# Altium project WS2812_MATRIX.PrjPcb
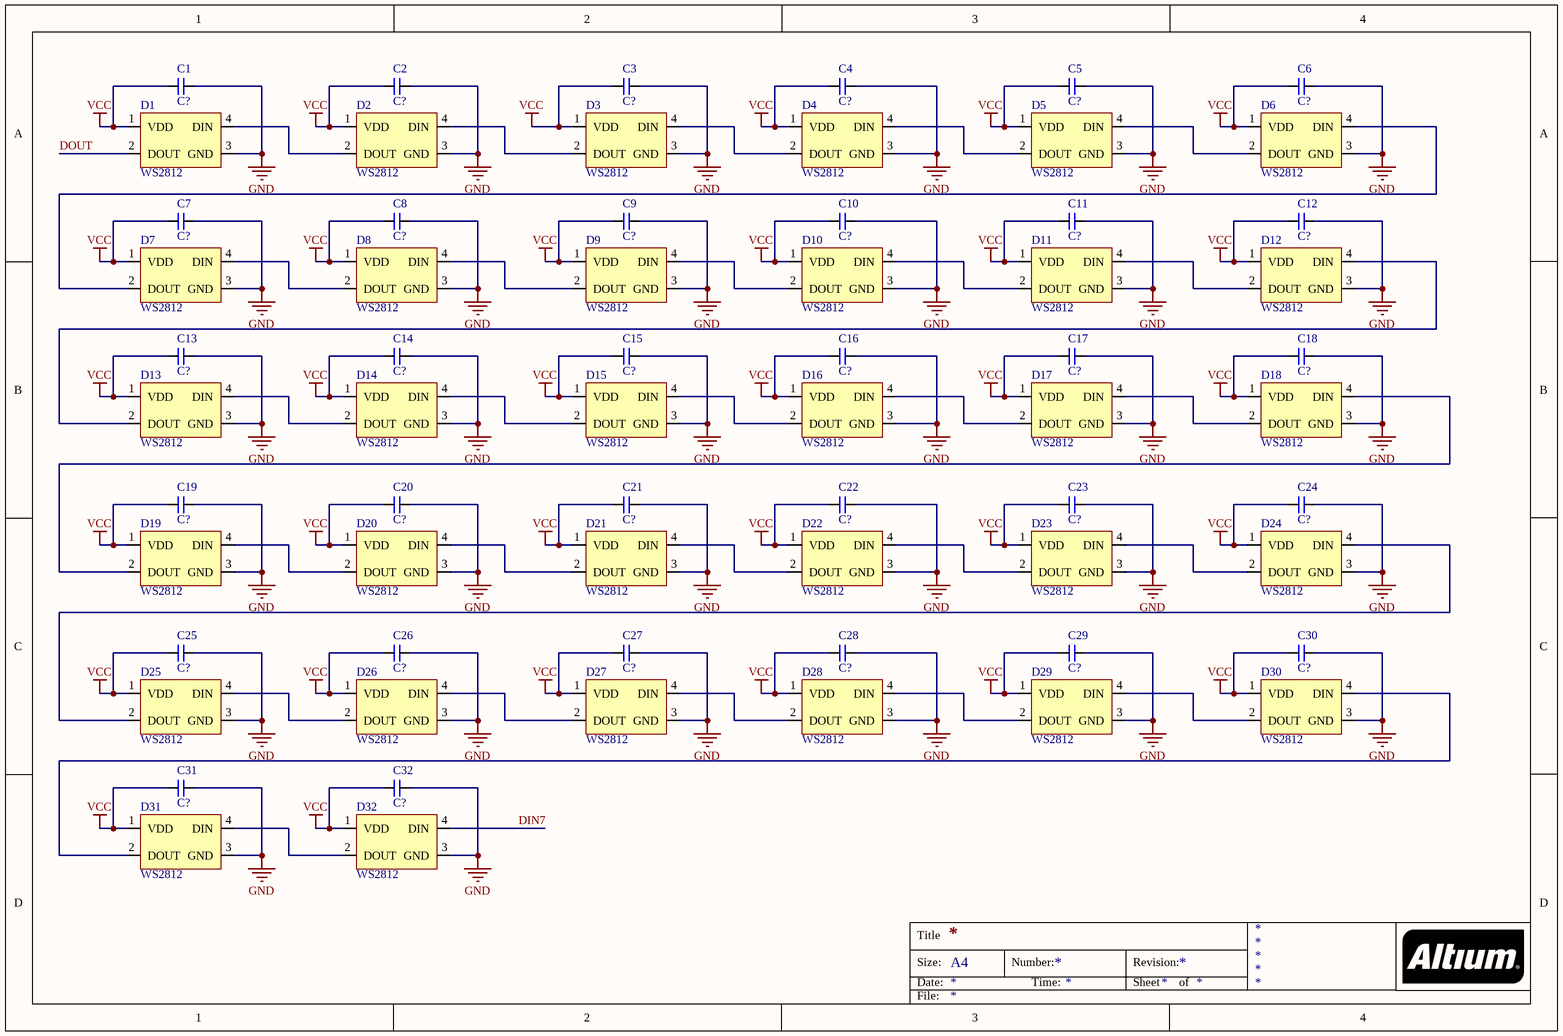
[diagram p0: WS2812_MATRIX_1.SchDoc]
8 sheets, 516 parts. Net scope: global (net labels, ports and power ports of the same name join across sheets).
Board file: WS2812_MATRIX.PcbDoc
Sheets:
  WS2812_MATRIX_1.SchDoc
  WS2812_MATRIX_2.SchDoc
  WS2812_MATRIX_3.SchDoc
  WS2812_MATRIX_4.SchDoc
  WS2812_MATRIX_5.SchDoc
  WS2812_MATRIX_6.SchDoc
  WS2812_MATRIX_7.SchDoc
  WS2812_MATRIX_8.SchDoc

## Sheet WS2812_MATRIX_1.SchDoc
size A4

### Parts
C1  C?  [C0603]
C2  C?  [C0603]
C3  C?  [C0603]
C4  C?  [C0603]
C5  C?  [C0603]
C6  C?  [C0603]
C7  C?  [C0603]
C8  C?  [C0603]
C9  C?  [C0603]
C10  C?  [C0603]
C11  C?  [C0603]
C12  C?  [C0603]
C13  C?  [C0603]
C14  C?  [C0603]
C15  C?  [C0603]
C16  C?  [C0603]
C17  C?  [C0603]
C18  C?  [C0603]
C19  C?  [C0603]
C20  C?  [C0603]
C21  C?  [C0603]
C22  C?  [C0603]
C23  C?  [C0603]
C24  C?  [C0603]
C25  C?  [C0603]
C26  C?  [C0603]
C27  C?  [C0603]
C28  C?  [C0603]
C29  C?  [C0603]
C30  C?  [C0603]
C31  C?  [C0603]
C32  C?  [C0603]
D1  WS2812  [WS2812_3528]
D2  WS2812  [WS2812_3528]
D3  WS2812  [WS2812_3528]
D4  WS2812  [WS2812_3528]
D5  WS2812  [WS2812_3528]
D6  WS2812  [WS2812_3528]
D7  WS2812  [WS2812_3528]
D8  WS2812  [WS2812_3528]
D9  WS2812  [WS2812_3528]
D10  WS2812  [WS2812_3528]
D11  WS2812  [WS2812_3528]
D12  WS2812  [WS2812_3528]
D13  WS2812  [WS2812_3528]
D14  WS2812  [WS2812_3528]
D15  WS2812  [WS2812_3528]
D16  WS2812  [WS2812_3528]
D17  WS2812  [WS2812_3528]
D18  WS2812  [WS2812_3528]
D19  WS2812  [WS2812_3528]
D20  WS2812  [WS2812_3528]
D21  WS2812  [WS2812_3528]
D22  WS2812  [WS2812_3528]
D23  WS2812  [WS2812_3528]
D24  WS2812  [WS2812_3528]
D25  WS2812  [WS2812_3528]
D26  WS2812  [WS2812_3528]
D27  WS2812  [WS2812_3528]
D28  WS2812  [WS2812_3528]
D29  WS2812  [WS2812_3528]
D30  WS2812  [WS2812_3528]
D31  WS2812  [WS2812_3528]
D32  WS2812  [WS2812_3528]

### Nets
GND: C1.2 C2.2 C3.2 C4.2 C5.2 C6.2 C7.2 C8.2 C9.2 C10.2 C11.2 C12.2 C13.2 C14.2 C15.2 C16.2 C17.2 C18.2 C19.2 C20.2 C21.2 C22.2 C23.2 C24.2 C25.2 C26.2 C27.2 C28.2 C29.2 C30.2 C31.2 C32.2 D1.3(GND) D2.3(GND) D3.3(GND) D4.3(GND) D5.3(GND) D6.3(GND) D7.3(GND) D8.3(GND) D9.3(GND) D10.3(GND) D11.3(GND) D12.3(GND) D13.3(GND) D14.3(GND) D15.3(GND) D16.3(GND) D17.3(GND) D18.3(GND) D19.3(GND) D20.3(GND) D21.3(GND) D22.3(GND) D23.3(GND) D24.3(GND) D25.3(GND) D26.3(GND) D27.3(GND) D28.3(GND) D29.3(GND) D30.3(GND) D31.3(GND) D32.3(GND)
VCC: C1.1 C2.1 C3.1 C4.1 C5.1 C6.1 C7.1 C8.1 C9.1 C10.1 C11.1 C12.1 C13.1 C14.1 C15.1 C16.1 C17.1 C18.1 C19.1 C20.1 C21.1 C22.1 C23.1 C24.1 C25.1 C26.1 C27.1 C28.1 C29.1 C30.1 C31.1 C32.1 D1.1(VDD) D2.1(VDD) D3.1(VDD) D4.1(VDD) D5.1(VDD) D6.1(VDD) D7.1(VDD) D8.1(VDD) D9.1(VDD) D10.1(VDD) D11.1(VDD) D12.1(VDD) D13.1(VDD) D14.1(VDD) D15.1(VDD) D16.1(VDD) D17.1(VDD) D18.1(VDD) D19.1(VDD) D20.1(VDD) D21.1(VDD) D22.1(VDD) D23.1(VDD) D24.1(VDD) D25.1(VDD) D26.1(VDD) D27.1(VDD) D28.1(VDD) D29.1(VDD) D30.1(VDD) D31.1(VDD) D32.1(VDD)
DIN7: D32.4(DIN)
DOUT: D1.2(DOUT)
NetD1_4: D1.4(DIN) D2.2(DOUT)
NetD2_4: D2.4(DIN) D3.2(DOUT)
NetD3_4: D3.4(DIN) D4.2(DOUT)
NetD4_4: D4.4(DIN) D5.2(DOUT)
NetD5_4: D5.4(DIN) D6.2(DOUT)
NetD6_4: D6.4(DIN) D7.2(DOUT)
NetD7_4: D7.4(DIN) D8.2(DOUT)
NetD8_4: D8.4(DIN) D9.2(DOUT)
NetD9_4: D9.4(DIN) D10.2(DOUT)
NetD10_4: D10.4(DIN) D11.2(DOUT)
NetD11_4: D11.4(DIN) D12.2(DOUT)
NetD12_4: D12.4(DIN) D13.2(DOUT)
NetD13_4: D13.4(DIN) D14.2(DOUT)
NetD14_4: D14.4(DIN) D15.2(DOUT)
NetD15_4: D15.4(DIN) D16.2(DOUT)
NetD16_4: D16.4(DIN) D17.2(DOUT)
NetD17_4: D17.4(DIN) D18.2(DOUT)
NetD18_4: D18.4(DIN) D19.2(DOUT)
NetD19_4: D19.4(DIN) D20.2(DOUT)
NetD20_4: D20.4(DIN) D21.2(DOUT)
NetD21_4: D21.4(DIN) D22.2(DOUT)
NetD22_4: D22.4(DIN) D23.2(DOUT)
NetD23_4: D23.4(DIN) D24.2(DOUT)
NetD24_4: D24.4(DIN) D25.2(DOUT)
NetD25_4: D25.4(DIN) D26.2(DOUT)
NetD26_4: D26.4(DIN) D27.2(DOUT)
NetD27_4: D27.4(DIN) D28.2(DOUT)
NetD28_4: D28.4(DIN) D29.2(DOUT)
NetD29_4: D29.4(DIN) D30.2(DOUT)
NetD30_4: D30.4(DIN) D31.2(DOUT)
NetD31_4: D31.4(DIN) D32.2(DOUT)

### Notes on the sheet
- Title
- Size:
- Date:
- A4
- Number:
- Time:
- Revision:
- Sheet
- of
- File:

### Library data of the parts
C1-C32 = CAP

## Sheet WS2812_MATRIX_2.SchDoc
size A4
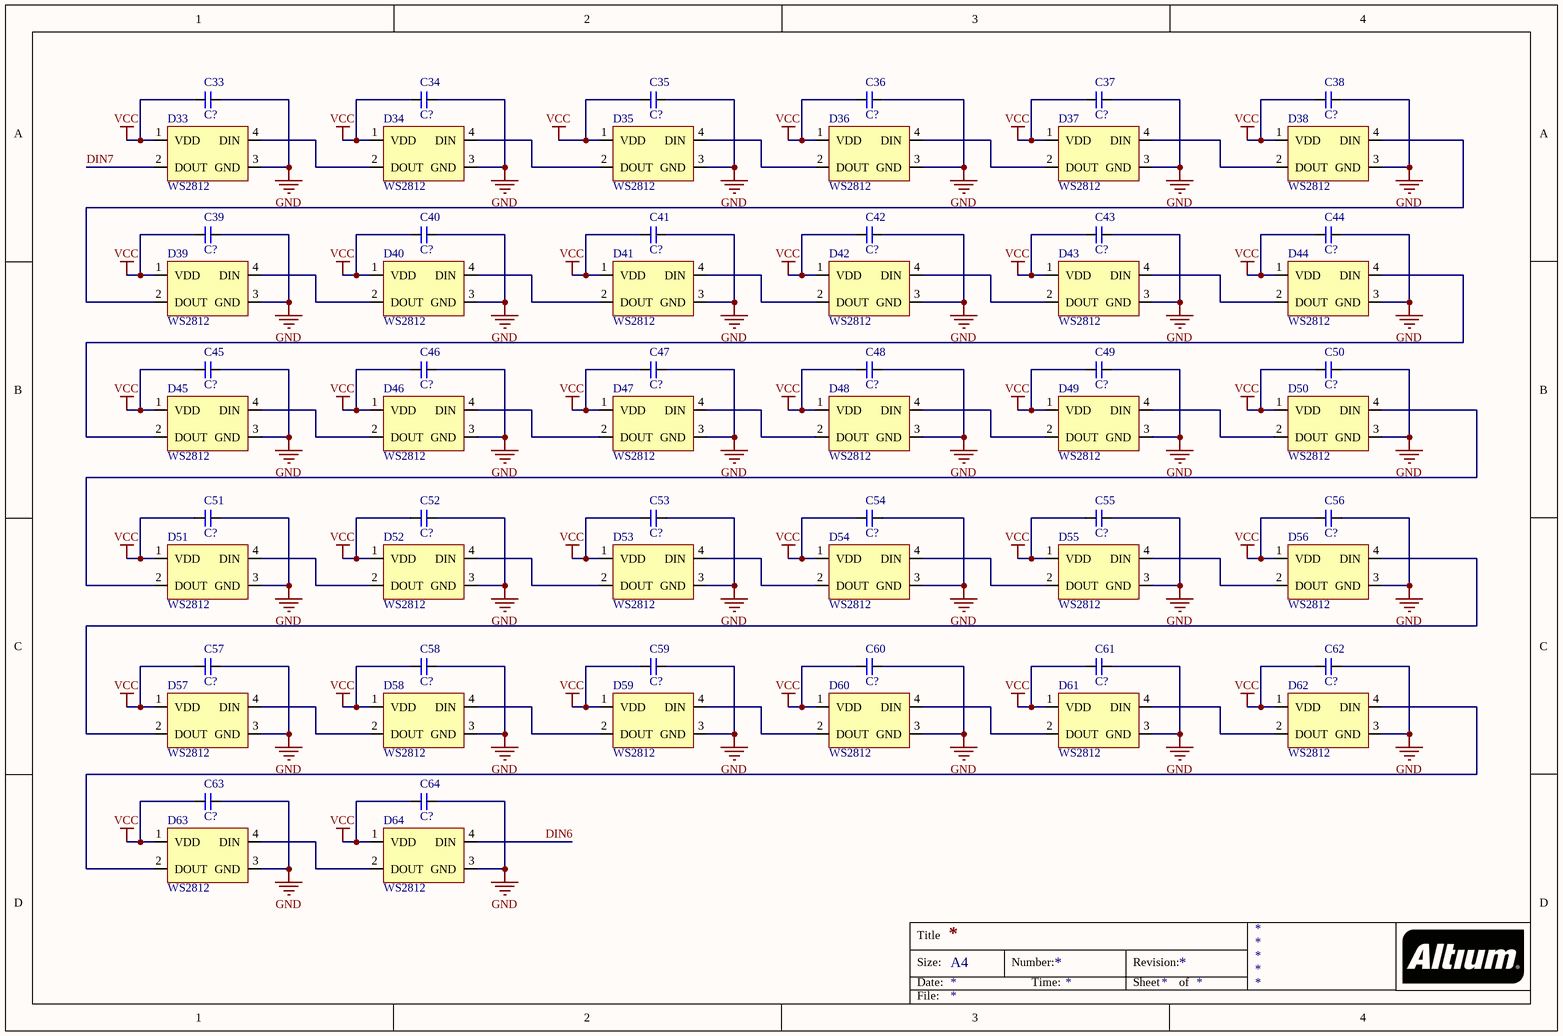
[diagram p1: WS2812_MATRIX_2.SchDoc]

### Parts
C33  C?  [C0603]
C34  C?  [C0603]
C35  C?  [C0603]
C36  C?  [C0603]
C37  C?  [C0603]
C38  C?  [C0603]
C39  C?  [C0603]
C40  C?  [C0603]
C41  C?  [C0603]
C42  C?  [C0603]
C43  C?  [C0603]
C44  C?  [C0603]
C45  C?  [C0603]
C46  C?  [C0603]
C47  C?  [C0603]
C48  C?  [C0603]
C49  C?  [C0603]
C50  C?  [C0603]
C51  C?  [C0603]
C52  C?  [C0603]
C53  C?  [C0603]
C54  C?  [C0603]
C55  C?  [C0603]
C56  C?  [C0603]
C57  C?  [C0603]
C58  C?  [C0603]
C59  C?  [C0603]
C60  C?  [C0603]
C61  C?  [C0603]
C62  C?  [C0603]
C63  C?  [C0603]
C64  C?  [C0603]
D33  WS2812  [WS2812_3528]
D34  WS2812  [WS2812_3528]
D35  WS2812  [WS2812_3528]
D36  WS2812  [WS2812_3528]
D37  WS2812  [WS2812_3528]
D38  WS2812  [WS2812_3528]
D39  WS2812  [WS2812_3528]
D40  WS2812  [WS2812_3528]
D41  WS2812  [WS2812_3528]
D42  WS2812  [WS2812_3528]
D43  WS2812  [WS2812_3528]
D44  WS2812  [WS2812_3528]
D45  WS2812  [WS2812_3528]
D46  WS2812  [WS2812_3528]
D47  WS2812  [WS2812_3528]
D48  WS2812  [WS2812_3528]
D49  WS2812  [WS2812_3528]
D50  WS2812  [WS2812_3528]
D51  WS2812  [WS2812_3528]
D52  WS2812  [WS2812_3528]
D53  WS2812  [WS2812_3528]
D54  WS2812  [WS2812_3528]
D55  WS2812  [WS2812_3528]
D56  WS2812  [WS2812_3528]
D57  WS2812  [WS2812_3528]
D58  WS2812  [WS2812_3528]
D59  WS2812  [WS2812_3528]
D60  WS2812  [WS2812_3528]
D61  WS2812  [WS2812_3528]
D62  WS2812  [WS2812_3528]
D63  WS2812  [WS2812_3528]
D64  WS2812  [WS2812_3528]

### Nets
GND: C33.2 C34.2 C35.2 C36.2 C37.2 C38.2 C39.2 C40.2 C41.2 C42.2 C43.2 C44.2 C45.2 C46.2 C47.2 C48.2 C49.2 C50.2 C51.2 C52.2 C53.2 C54.2 C55.2 C56.2 C57.2 C58.2 C59.2 C60.2 C61.2 C62.2 C63.2 C64.2 D33.3(GND) D34.3(GND) D35.3(GND) D36.3(GND) D37.3(GND) D38.3(GND) D39.3(GND) D40.3(GND) D41.3(GND) D42.3(GND) D43.3(GND) D44.3(GND) D45.3(GND) D46.3(GND) D47.3(GND) D48.3(GND) D49.3(GND) D50.3(GND) D51.3(GND) D52.3(GND) D53.3(GND) D54.3(GND) D55.3(GND) D56.3(GND) D57.3(GND) D58.3(GND) D59.3(GND) D60.3(GND) D61.3(GND) D62.3(GND) D63.3(GND) D64.3(GND)
VCC: C33.1 C34.1 C35.1 C36.1 C37.1 C38.1 C39.1 C40.1 C41.1 C42.1 C43.1 C44.1 C45.1 C46.1 C47.1 C48.1 C49.1 C50.1 C51.1 C52.1 C53.1 C54.1 C55.1 C56.1 C57.1 C58.1 C59.1 C60.1 C61.1 C62.1 C63.1 C64.1 D33.1(VDD) D34.1(VDD) D35.1(VDD) D36.1(VDD) D37.1(VDD) D38.1(VDD) D39.1(VDD) D40.1(VDD) D41.1(VDD) D42.1(VDD) D43.1(VDD) D44.1(VDD) D45.1(VDD) D46.1(VDD) D47.1(VDD) D48.1(VDD) D49.1(VDD) D50.1(VDD) D51.1(VDD) D52.1(VDD) D53.1(VDD) D54.1(VDD) D55.1(VDD) D56.1(VDD) D57.1(VDD) D58.1(VDD) D59.1(VDD) D60.1(VDD) D61.1(VDD) D62.1(VDD) D63.1(VDD) D64.1(VDD)
DIN6: D64.4(DIN)
DIN7: D33.2(DOUT)
NetD33_4: D33.4(DIN) D34.2(DOUT)
NetD34_4: D34.4(DIN) D35.2(DOUT)
NetD35_4: D35.4(DIN) D36.2(DOUT)
NetD36_4: D36.4(DIN) D37.2(DOUT)
NetD37_4: D37.4(DIN) D38.2(DOUT)
NetD38_4: D38.4(DIN) D39.2(DOUT)
NetD39_4: D39.4(DIN) D40.2(DOUT)
NetD40_4: D40.4(DIN) D41.2(DOUT)
NetD41_4: D41.4(DIN) D42.2(DOUT)
NetD42_4: D42.4(DIN) D43.2(DOUT)
NetD43_4: D43.4(DIN) D44.2(DOUT)
NetD44_4: D44.4(DIN) D45.2(DOUT)
NetD45_4: D45.4(DIN) D46.2(DOUT)
NetD46_4: D46.4(DIN) D47.2(DOUT)
NetD47_4: D47.4(DIN) D48.2(DOUT)
NetD48_4: D48.4(DIN) D49.2(DOUT)
NetD49_4: D49.4(DIN) D50.2(DOUT)
NetD50_4: D50.4(DIN) D51.2(DOUT)
NetD51_4: D51.4(DIN) D52.2(DOUT)
NetD52_4: D52.4(DIN) D53.2(DOUT)
NetD53_4: D53.4(DIN) D54.2(DOUT)
NetD54_4: D54.4(DIN) D55.2(DOUT)
NetD55_4: D55.4(DIN) D56.2(DOUT)
NetD56_4: D56.4(DIN) D57.2(DOUT)
NetD57_4: D57.4(DIN) D58.2(DOUT)
NetD58_4: D58.4(DIN) D59.2(DOUT)
NetD59_4: D59.4(DIN) D60.2(DOUT)
NetD60_4: D60.4(DIN) D61.2(DOUT)
NetD61_4: D61.4(DIN) D62.2(DOUT)
NetD62_4: D62.4(DIN) D63.2(DOUT)
NetD63_4: D63.4(DIN) D64.2(DOUT)

### Notes on the sheet
- Title
- Size:
- Date:
- A4
- Number:
- Time:
- Revision:
- Sheet
- of
- File:

### Library data of the parts
C33-C64 = CAP

## Sheet WS2812_MATRIX_3.SchDoc
size A4
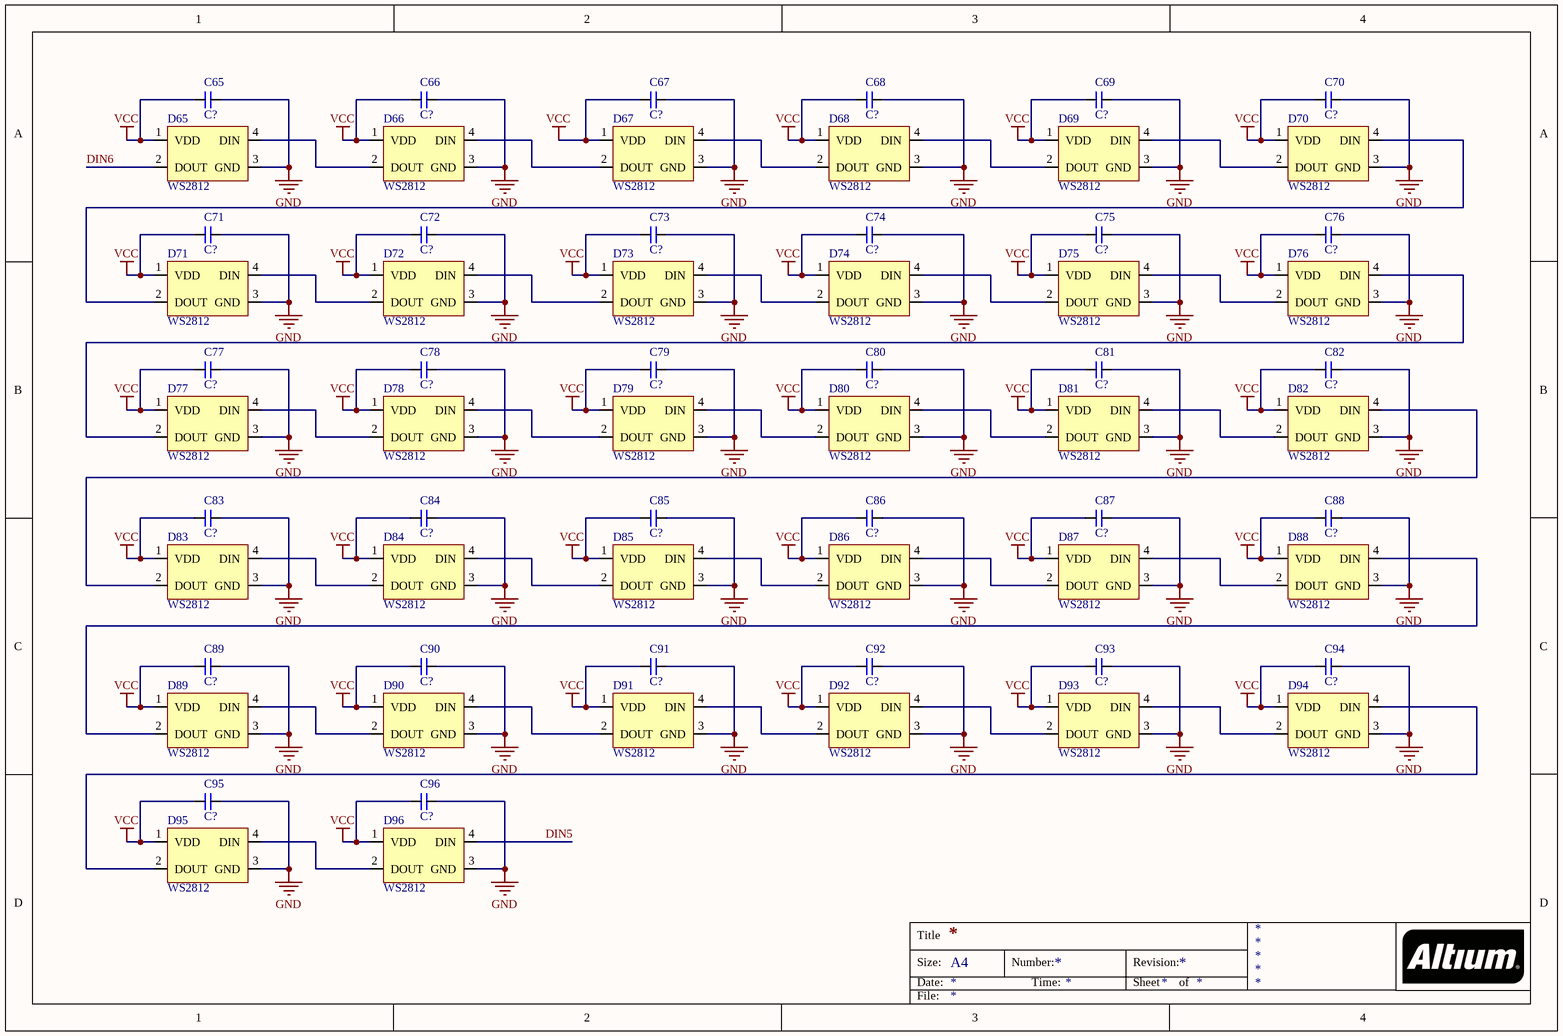
[diagram p2: WS2812_MATRIX_3.SchDoc]

### Parts
C65  C?  [C0603]
C66  C?  [C0603]
C67  C?  [C0603]
C68  C?  [C0603]
C69  C?  [C0603]
C70  C?  [C0603]
C71  C?  [C0603]
C72  C?  [C0603]
C73  C?  [C0603]
C74  C?  [C0603]
C75  C?  [C0603]
C76  C?  [C0603]
C77  C?  [C0603]
C78  C?  [C0603]
C79  C?  [C0603]
C80  C?  [C0603]
C81  C?  [C0603]
C82  C?  [C0603]
C83  C?  [C0603]
C84  C?  [C0603]
C85  C?  [C0603]
C86  C?  [C0603]
C87  C?  [C0603]
C88  C?  [C0603]
C89  C?  [C0603]
C90  C?  [C0603]
C91  C?  [C0603]
C92  C?  [C0603]
C93  C?  [C0603]
C94  C?  [C0603]
C95  C?  [C0603]
C96  C?  [C0603]
D65  WS2812  [WS2812_3528]
D66  WS2812  [WS2812_3528]
D67  WS2812  [WS2812_3528]
D68  WS2812  [WS2812_3528]
D69  WS2812  [WS2812_3528]
D70  WS2812  [WS2812_3528]
D71  WS2812  [WS2812_3528]
D72  WS2812  [WS2812_3528]
D73  WS2812  [WS2812_3528]
D74  WS2812  [WS2812_3528]
D75  WS2812  [WS2812_3528]
D76  WS2812  [WS2812_3528]
D77  WS2812  [WS2812_3528]
D78  WS2812  [WS2812_3528]
D79  WS2812  [WS2812_3528]
D80  WS2812  [WS2812_3528]
D81  WS2812  [WS2812_3528]
D82  WS2812  [WS2812_3528]
D83  WS2812  [WS2812_3528]
D84  WS2812  [WS2812_3528]
D85  WS2812  [WS2812_3528]
D86  WS2812  [WS2812_3528]
D87  WS2812  [WS2812_3528]
D88  WS2812  [WS2812_3528]
D89  WS2812  [WS2812_3528]
D90  WS2812  [WS2812_3528]
D91  WS2812  [WS2812_3528]
D92  WS2812  [WS2812_3528]
D93  WS2812  [WS2812_3528]
D94  WS2812  [WS2812_3528]
D95  WS2812  [WS2812_3528]
D96  WS2812  [WS2812_3528]

### Nets
GND: C65.2 C66.2 C67.2 C68.2 C69.2 C70.2 C71.2 C72.2 C73.2 C74.2 C75.2 C76.2 C77.2 C78.2 C79.2 C80.2 C81.2 C82.2 C83.2 C84.2 C85.2 C86.2 C87.2 C88.2 C89.2 C90.2 C91.2 C92.2 C93.2 C94.2 C95.2 C96.2 D65.3(GND) D66.3(GND) D67.3(GND) D68.3(GND) D69.3(GND) D70.3(GND) D71.3(GND) D72.3(GND) D73.3(GND) D74.3(GND) D75.3(GND) D76.3(GND) D77.3(GND) D78.3(GND) D79.3(GND) D80.3(GND) D81.3(GND) D82.3(GND) D83.3(GND) D84.3(GND) D85.3(GND) D86.3(GND) D87.3(GND) D88.3(GND) D89.3(GND) D90.3(GND) D91.3(GND) D92.3(GND) D93.3(GND) D94.3(GND) D95.3(GND) D96.3(GND)
VCC: C65.1 C66.1 C67.1 C68.1 C69.1 C70.1 C71.1 C72.1 C73.1 C74.1 C75.1 C76.1 C77.1 C78.1 C79.1 C80.1 C81.1 C82.1 C83.1 C84.1 C85.1 C86.1 C87.1 C88.1 C89.1 C90.1 C91.1 C92.1 C93.1 C94.1 C95.1 C96.1 D65.1(VDD) D66.1(VDD) D67.1(VDD) D68.1(VDD) D69.1(VDD) D70.1(VDD) D71.1(VDD) D72.1(VDD) D73.1(VDD) D74.1(VDD) D75.1(VDD) D76.1(VDD) D77.1(VDD) D78.1(VDD) D79.1(VDD) D80.1(VDD) D81.1(VDD) D82.1(VDD) D83.1(VDD) D84.1(VDD) D85.1(VDD) D86.1(VDD) D87.1(VDD) D88.1(VDD) D89.1(VDD) D90.1(VDD) D91.1(VDD) D92.1(VDD) D93.1(VDD) D94.1(VDD) D95.1(VDD) D96.1(VDD)
DIN5: D96.4(DIN)
DIN6: D65.2(DOUT)
NetD65_4: D65.4(DIN) D66.2(DOUT)
NetD66_4: D66.4(DIN) D67.2(DOUT)
NetD67_4: D67.4(DIN) D68.2(DOUT)
NetD68_4: D68.4(DIN) D69.2(DOUT)
NetD69_4: D69.4(DIN) D70.2(DOUT)
NetD70_4: D70.4(DIN) D71.2(DOUT)
NetD71_4: D71.4(DIN) D72.2(DOUT)
NetD72_4: D72.4(DIN) D73.2(DOUT)
NetD73_4: D73.4(DIN) D74.2(DOUT)
NetD74_4: D74.4(DIN) D75.2(DOUT)
NetD75_4: D75.4(DIN) D76.2(DOUT)
NetD76_4: D76.4(DIN) D77.2(DOUT)
NetD77_4: D77.4(DIN) D78.2(DOUT)
NetD78_4: D78.4(DIN) D79.2(DOUT)
NetD79_4: D79.4(DIN) D80.2(DOUT)
NetD80_4: D80.4(DIN) D81.2(DOUT)
NetD81_4: D81.4(DIN) D82.2(DOUT)
NetD82_4: D82.4(DIN) D83.2(DOUT)
NetD83_4: D83.4(DIN) D84.2(DOUT)
NetD84_4: D84.4(DIN) D85.2(DOUT)
NetD85_4: D85.4(DIN) D86.2(DOUT)
NetD86_4: D86.4(DIN) D87.2(DOUT)
NetD87_4: D87.4(DIN) D88.2(DOUT)
NetD88_4: D88.4(DIN) D89.2(DOUT)
NetD89_4: D89.4(DIN) D90.2(DOUT)
NetD90_4: D90.4(DIN) D91.2(DOUT)
NetD91_4: D91.4(DIN) D92.2(DOUT)
NetD92_4: D92.4(DIN) D93.2(DOUT)
NetD93_4: D93.4(DIN) D94.2(DOUT)
NetD94_4: D94.4(DIN) D95.2(DOUT)
NetD95_4: D95.4(DIN) D96.2(DOUT)

### Notes on the sheet
- Title
- Size:
- Date:
- A4
- Number:
- Time:
- Revision:
- Sheet
- of
- File:

### Library data of the parts
C65-C96 = CAP

## Sheet WS2812_MATRIX_4.SchDoc
size A4
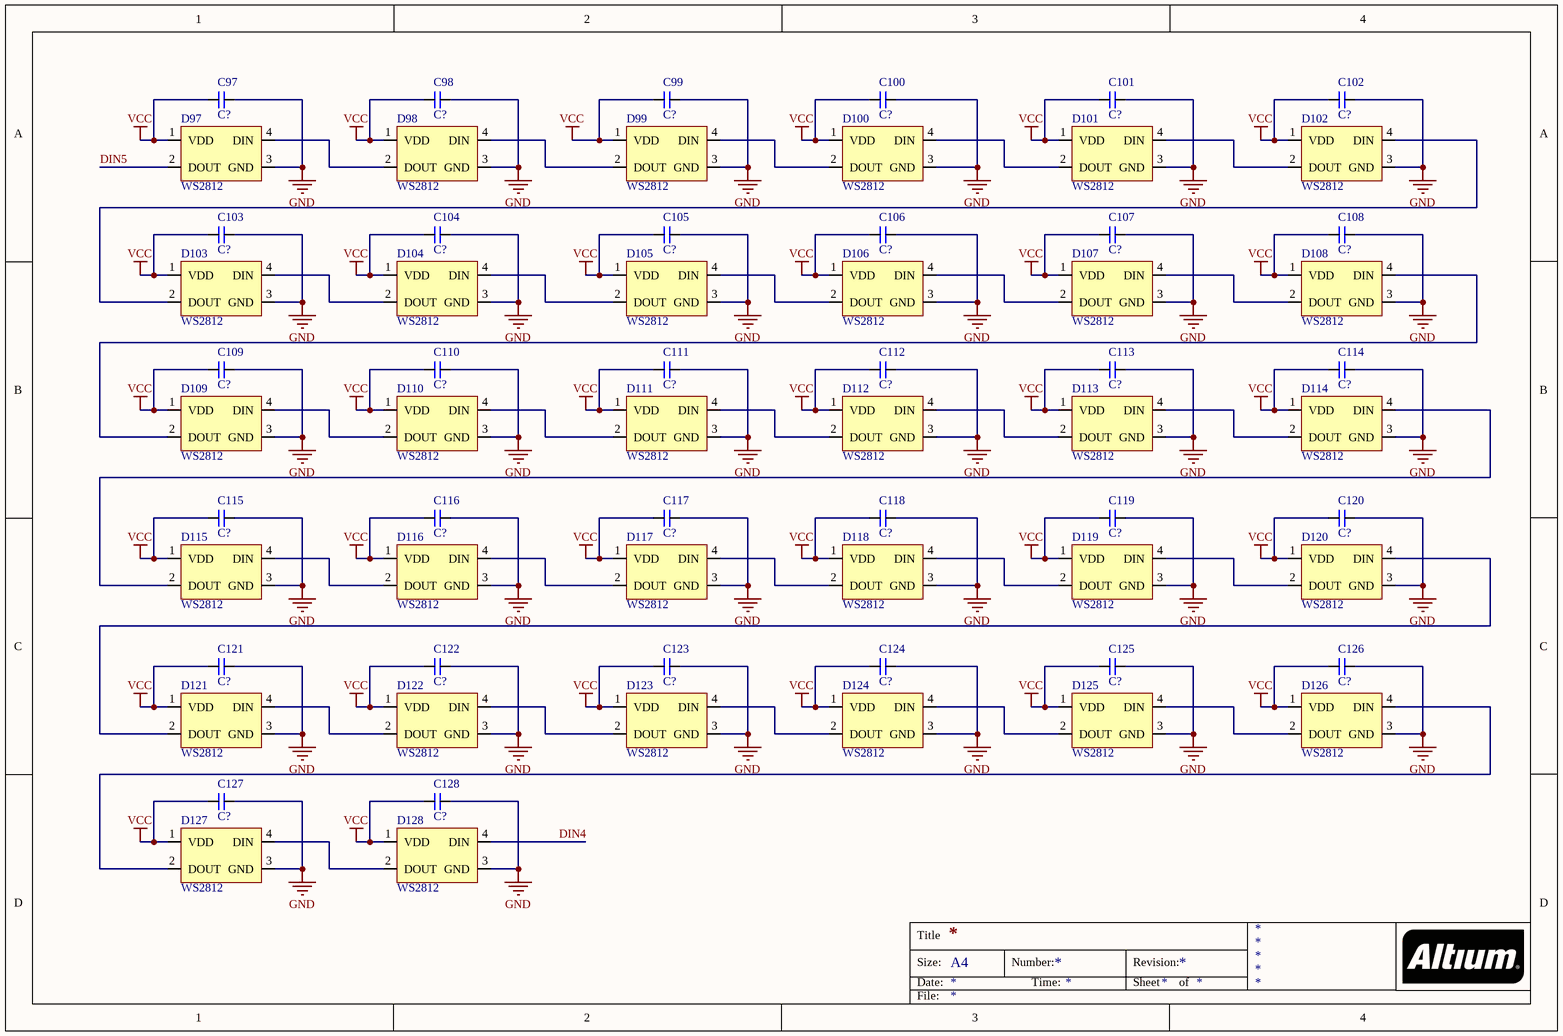
[diagram p3: WS2812_MATRIX_4.SchDoc]

### Parts
C97  C?  [C0603]
C98  C?  [C0603]
C99  C?  [C0603]
C100  C?  [C0603]
C101  C?  [C0603]
C102  C?  [C0603]
C103  C?  [C0603]
C104  C?  [C0603]
C105  C?  [C0603]
C106  C?  [C0603]
C107  C?  [C0603]
C108  C?  [C0603]
C109  C?  [C0603]
C110  C?  [C0603]
C111  C?  [C0603]
C112  C?  [C0603]
C113  C?  [C0603]
C114  C?  [C0603]
C115  C?  [C0603]
C116  C?  [C0603]
C117  C?  [C0603]
C118  C?  [C0603]
C119  C?  [C0603]
C120  C?  [C0603]
C121  C?  [C0603]
C122  C?  [C0603]
C123  C?  [C0603]
C124  C?  [C0603]
C125  C?  [C0603]
C126  C?  [C0603]
C127  C?  [C0603]
C128  C?  [C0603]
D97  WS2812  [WS2812_3528]
D98  WS2812  [WS2812_3528]
D99  WS2812  [WS2812_3528]
D100  WS2812  [WS2812_3528]
D101  WS2812  [WS2812_3528]
D102  WS2812  [WS2812_3528]
D103  WS2812  [WS2812_3528]
D104  WS2812  [WS2812_3528]
D105  WS2812  [WS2812_3528]
D106  WS2812  [WS2812_3528]
D107  WS2812  [WS2812_3528]
D108  WS2812  [WS2812_3528]
D109  WS2812  [WS2812_3528]
D110  WS2812  [WS2812_3528]
D111  WS2812  [WS2812_3528]
D112  WS2812  [WS2812_3528]
D113  WS2812  [WS2812_3528]
D114  WS2812  [WS2812_3528]
D115  WS2812  [WS2812_3528]
D116  WS2812  [WS2812_3528]
D117  WS2812  [WS2812_3528]
D118  WS2812  [WS2812_3528]
D119  WS2812  [WS2812_3528]
D120  WS2812  [WS2812_3528]
D121  WS2812  [WS2812_3528]
D122  WS2812  [WS2812_3528]
D123  WS2812  [WS2812_3528]
D124  WS2812  [WS2812_3528]
D125  WS2812  [WS2812_3528]
D126  WS2812  [WS2812_3528]
D127  WS2812  [WS2812_3528]
D128  WS2812  [WS2812_3528]

### Nets
GND: C97.2 C98.2 C99.2 C100.2 C101.2 C102.2 C103.2 C104.2 C105.2 C106.2 C107.2 C108.2 C109.2 C110.2 C111.2 C112.2 C113.2 C114.2 C115.2 C116.2 C117.2 C118.2 C119.2 C120.2 C121.2 C122.2 C123.2 C124.2 C125.2 C126.2 C127.2 C128.2 D97.3(GND) D98.3(GND) D99.3(GND) D100.3(GND) D101.3(GND) D102.3(GND) D103.3(GND) D104.3(GND) D105.3(GND) D106.3(GND) D107.3(GND) D108.3(GND) D109.3(GND) D110.3(GND) D111.3(GND) D112.3(GND) D113.3(GND) D114.3(GND) D115.3(GND) D116.3(GND) D117.3(GND) D118.3(GND) D119.3(GND) D120.3(GND) D121.3(GND) D122.3(GND) D123.3(GND) D124.3(GND) D125.3(GND) D126.3(GND) D127.3(GND) D128.3(GND)
VCC: C97.1 C98.1 C99.1 C100.1 C101.1 C102.1 C103.1 C104.1 C105.1 C106.1 C107.1 C108.1 C109.1 C110.1 C111.1 C112.1 C113.1 C114.1 C115.1 C116.1 C117.1 C118.1 C119.1 C120.1 C121.1 C122.1 C123.1 C124.1 C125.1 C126.1 C127.1 C128.1 D97.1(VDD) D98.1(VDD) D99.1(VDD) D100.1(VDD) D101.1(VDD) D102.1(VDD) D103.1(VDD) D104.1(VDD) D105.1(VDD) D106.1(VDD) D107.1(VDD) D108.1(VDD) D109.1(VDD) D110.1(VDD) D111.1(VDD) D112.1(VDD) D113.1(VDD) D114.1(VDD) D115.1(VDD) D116.1(VDD) D117.1(VDD) D118.1(VDD) D119.1(VDD) D120.1(VDD) D121.1(VDD) D122.1(VDD) D123.1(VDD) D124.1(VDD) D125.1(VDD) D126.1(VDD) D127.1(VDD) D128.1(VDD)
DIN4: D128.4(DIN)
DIN5: D97.2(DOUT)
NetD97_4: D97.4(DIN) D98.2(DOUT)
NetD98_4: D98.4(DIN) D99.2(DOUT)
NetD99_4: D99.4(DIN) D100.2(DOUT)
NetD100_4: D100.4(DIN) D101.2(DOUT)
NetD101_4: D101.4(DIN) D102.2(DOUT)
NetD102_4: D102.4(DIN) D103.2(DOUT)
NetD103_4: D103.4(DIN) D104.2(DOUT)
NetD104_4: D104.4(DIN) D105.2(DOUT)
NetD105_4: D105.4(DIN) D106.2(DOUT)
NetD106_4: D106.4(DIN) D107.2(DOUT)
NetD107_4: D107.4(DIN) D108.2(DOUT)
NetD108_4: D108.4(DIN) D109.2(DOUT)
NetD109_4: D109.4(DIN) D110.2(DOUT)
NetD110_4: D110.4(DIN) D111.2(DOUT)
NetD111_4: D111.4(DIN) D112.2(DOUT)
NetD112_4: D112.4(DIN) D113.2(DOUT)
NetD113_4: D113.4(DIN) D114.2(DOUT)
NetD114_4: D114.4(DIN) D115.2(DOUT)
NetD115_4: D115.4(DIN) D116.2(DOUT)
NetD116_4: D116.4(DIN) D117.2(DOUT)
NetD117_4: D117.4(DIN) D118.2(DOUT)
NetD118_4: D118.4(DIN) D119.2(DOUT)
NetD119_4: D119.4(DIN) D120.2(DOUT)
NetD120_4: D120.4(DIN) D121.2(DOUT)
NetD121_4: D121.4(DIN) D122.2(DOUT)
NetD122_4: D122.4(DIN) D123.2(DOUT)
NetD123_4: D123.4(DIN) D124.2(DOUT)
NetD124_4: D124.4(DIN) D125.2(DOUT)
NetD125_4: D125.4(DIN) D126.2(DOUT)
NetD126_4: D126.4(DIN) D127.2(DOUT)
NetD127_4: D127.4(DIN) D128.2(DOUT)

### Notes on the sheet
- Title
- Size:
- Date:
- A4
- Number:
- Time:
- Revision:
- Sheet
- of
- File:

### Library data of the parts
C97-C128 = CAP

## Sheet WS2812_MATRIX_5.SchDoc
size A4
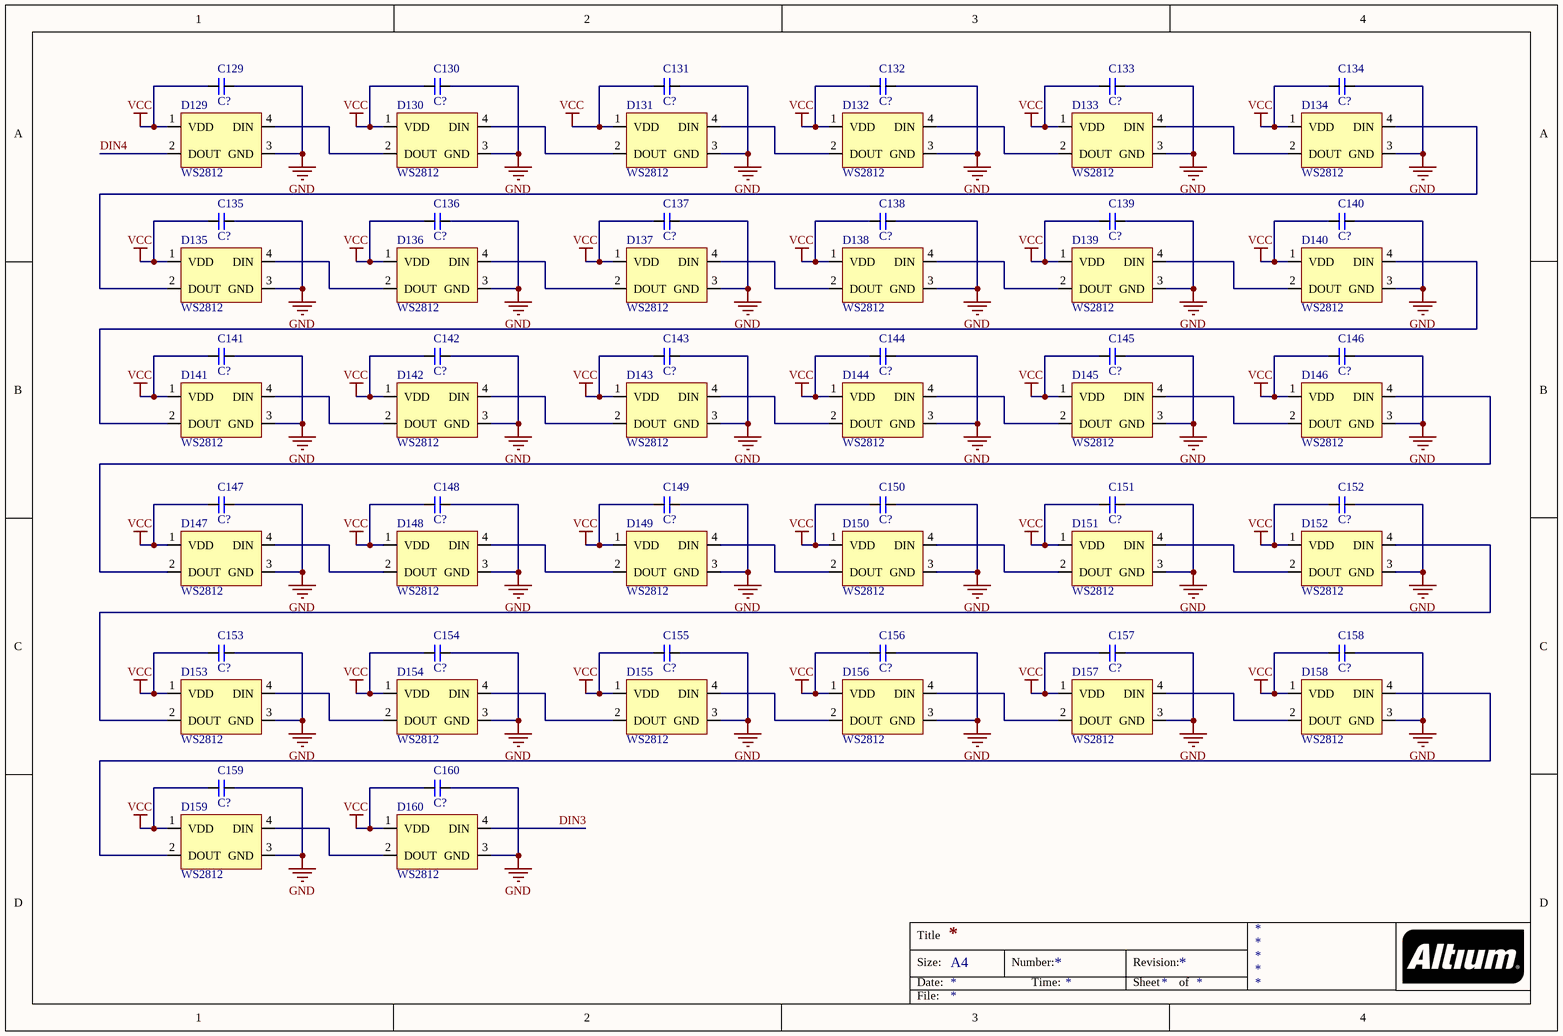
[diagram p4: WS2812_MATRIX_5.SchDoc]

### Parts
C129  C?  [C0603]
C130  C?  [C0603]
C131  C?  [C0603]
C132  C?  [C0603]
C133  C?  [C0603]
C134  C?  [C0603]
C135  C?  [C0603]
C136  C?  [C0603]
C137  C?  [C0603]
C138  C?  [C0603]
C139  C?  [C0603]
C140  C?  [C0603]
C141  C?  [C0603]
C142  C?  [C0603]
C143  C?  [C0603]
C144  C?  [C0603]
C145  C?  [C0603]
C146  C?  [C0603]
C147  C?  [C0603]
C148  C?  [C0603]
C149  C?  [C0603]
C150  C?  [C0603]
C151  C?  [C0603]
C152  C?  [C0603]
C153  C?  [C0603]
C154  C?  [C0603]
C155  C?  [C0603]
C156  C?  [C0603]
C157  C?  [C0603]
C158  C?  [C0603]
C159  C?  [C0603]
C160  C?  [C0603]
D129  WS2812  [WS2812_3528]
D130  WS2812  [WS2812_3528]
D131  WS2812  [WS2812_3528]
D132  WS2812  [WS2812_3528]
D133  WS2812  [WS2812_3528]
D134  WS2812  [WS2812_3528]
D135  WS2812  [WS2812_3528]
D136  WS2812  [WS2812_3528]
D137  WS2812  [WS2812_3528]
D138  WS2812  [WS2812_3528]
D139  WS2812  [WS2812_3528]
D140  WS2812  [WS2812_3528]
D141  WS2812  [WS2812_3528]
D142  WS2812  [WS2812_3528]
D143  WS2812  [WS2812_3528]
D144  WS2812  [WS2812_3528]
D145  WS2812  [WS2812_3528]
D146  WS2812  [WS2812_3528]
D147  WS2812  [WS2812_3528]
D148  WS2812  [WS2812_3528]
D149  WS2812  [WS2812_3528]
D150  WS2812  [WS2812_3528]
D151  WS2812  [WS2812_3528]
D152  WS2812  [WS2812_3528]
D153  WS2812  [WS2812_3528]
D154  WS2812  [WS2812_3528]
D155  WS2812  [WS2812_3528]
D156  WS2812  [WS2812_3528]
D157  WS2812  [WS2812_3528]
D158  WS2812  [WS2812_3528]
D159  WS2812  [WS2812_3528]
D160  WS2812  [WS2812_3528]

### Nets
GND: C129.2 C130.2 C131.2 C132.2 C133.2 C134.2 C135.2 C136.2 C137.2 C138.2 C139.2 C140.2 C141.2 C142.2 C143.2 C144.2 C145.2 C146.2 C147.2 C148.2 C149.2 C150.2 C151.2 C152.2 C153.2 C154.2 C155.2 C156.2 C157.2 C158.2 C159.2 C160.2 D129.3(GND) D130.3(GND) D131.3(GND) D132.3(GND) D133.3(GND) D134.3(GND) D135.3(GND) D136.3(GND) D137.3(GND) D138.3(GND) D139.3(GND) D140.3(GND) D141.3(GND) D142.3(GND) D143.3(GND) D144.3(GND) D145.3(GND) D146.3(GND) D147.3(GND) D148.3(GND) D149.3(GND) D150.3(GND) D151.3(GND) D152.3(GND) D153.3(GND) D154.3(GND) D155.3(GND) D156.3(GND) D157.3(GND) D158.3(GND) D159.3(GND) D160.3(GND)
VCC: C129.1 C130.1 C131.1 C132.1 C133.1 C134.1 C135.1 C136.1 C137.1 C138.1 C139.1 C140.1 C141.1 C142.1 C143.1 C144.1 C145.1 C146.1 C147.1 C148.1 C149.1 C150.1 C151.1 C152.1 C153.1 C154.1 C155.1 C156.1 C157.1 C158.1 C159.1 C160.1 D129.1(VDD) D130.1(VDD) D131.1(VDD) D132.1(VDD) D133.1(VDD) D134.1(VDD) D135.1(VDD) D136.1(VDD) D137.1(VDD) D138.1(VDD) D139.1(VDD) D140.1(VDD) D141.1(VDD) D142.1(VDD) D143.1(VDD) D144.1(VDD) D145.1(VDD) D146.1(VDD) D147.1(VDD) D148.1(VDD) D149.1(VDD) D150.1(VDD) D151.1(VDD) D152.1(VDD) D153.1(VDD) D154.1(VDD) D155.1(VDD) D156.1(VDD) D157.1(VDD) D158.1(VDD) D159.1(VDD) D160.1(VDD)
DIN3: D160.4(DIN)
DIN4: D129.2(DOUT)
NetD129_4: D129.4(DIN) D130.2(DOUT)
NetD130_4: D130.4(DIN) D131.2(DOUT)
NetD131_4: D131.4(DIN) D132.2(DOUT)
NetD132_4: D132.4(DIN) D133.2(DOUT)
NetD133_4: D133.4(DIN) D134.2(DOUT)
NetD134_4: D134.4(DIN) D135.2(DOUT)
NetD135_4: D135.4(DIN) D136.2(DOUT)
NetD136_4: D136.4(DIN) D137.2(DOUT)
NetD137_4: D137.4(DIN) D138.2(DOUT)
NetD138_4: D138.4(DIN) D139.2(DOUT)
NetD139_4: D139.4(DIN) D140.2(DOUT)
NetD140_4: D140.4(DIN) D141.2(DOUT)
NetD141_4: D141.4(DIN) D142.2(DOUT)
NetD142_4: D142.4(DIN) D143.2(DOUT)
NetD143_4: D143.4(DIN) D144.2(DOUT)
NetD144_4: D144.4(DIN) D145.2(DOUT)
NetD145_4: D145.4(DIN) D146.2(DOUT)
NetD146_4: D146.4(DIN) D147.2(DOUT)
NetD147_4: D147.4(DIN) D148.2(DOUT)
NetD148_4: D148.4(DIN) D149.2(DOUT)
NetD149_4: D149.4(DIN) D150.2(DOUT)
NetD150_4: D150.4(DIN) D151.2(DOUT)
NetD151_4: D151.4(DIN) D152.2(DOUT)
NetD152_4: D152.4(DIN) D153.2(DOUT)
NetD153_4: D153.4(DIN) D154.2(DOUT)
NetD154_4: D154.4(DIN) D155.2(DOUT)
NetD155_4: D155.4(DIN) D156.2(DOUT)
NetD156_4: D156.4(DIN) D157.2(DOUT)
NetD157_4: D157.4(DIN) D158.2(DOUT)
NetD158_4: D158.4(DIN) D159.2(DOUT)
NetD159_4: D159.4(DIN) D160.2(DOUT)

### Notes on the sheet
- Title
- Size:
- Date:
- A4
- Number:
- Time:
- Revision:
- Sheet
- of
- File:

### Library data of the parts
C129-C160 = CAP

## Sheet WS2812_MATRIX_6.SchDoc
size A4
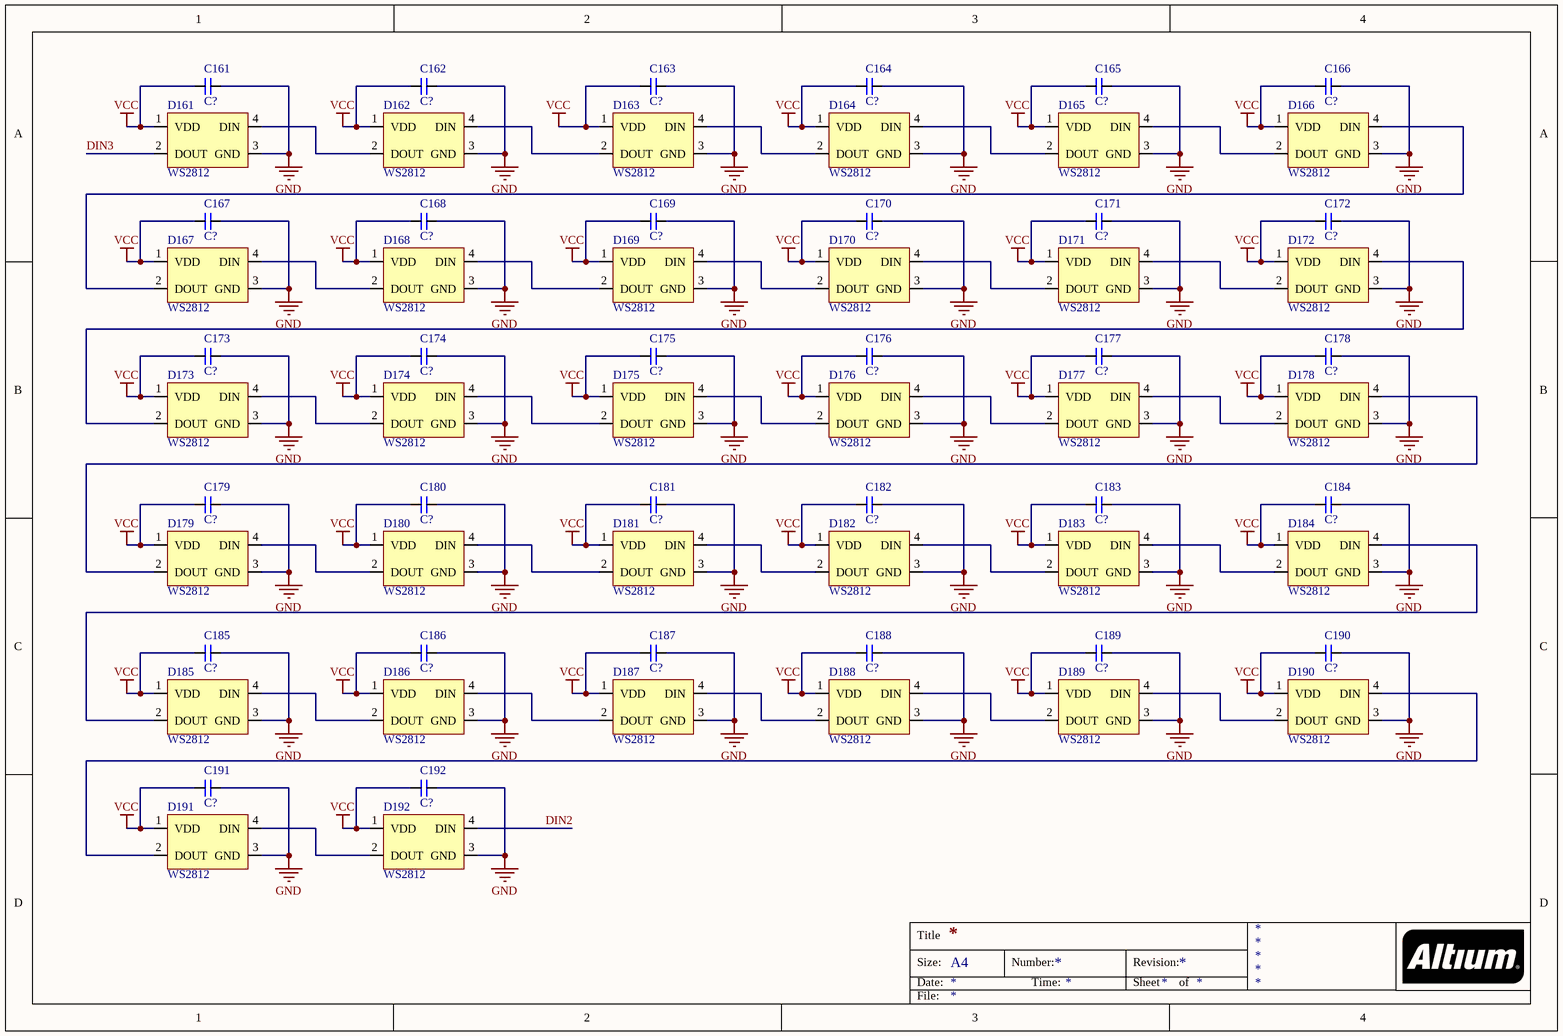
[diagram p5: WS2812_MATRIX_6.SchDoc]

### Parts
C161  C?  [C0603]
C162  C?  [C0603]
C163  C?  [C0603]
C164  C?  [C0603]
C165  C?  [C0603]
C166  C?  [C0603]
C167  C?  [C0603]
C168  C?  [C0603]
C169  C?  [C0603]
C170  C?  [C0603]
C171  C?  [C0603]
C172  C?  [C0603]
C173  C?  [C0603]
C174  C?  [C0603]
C175  C?  [C0603]
C176  C?  [C0603]
C177  C?  [C0603]
C178  C?  [C0603]
C179  C?  [C0603]
C180  C?  [C0603]
C181  C?  [C0603]
C182  C?  [C0603]
C183  C?  [C0603]
C184  C?  [C0603]
C185  C?  [C0603]
C186  C?  [C0603]
C187  C?  [C0603]
C188  C?  [C0603]
C189  C?  [C0603]
C190  C?  [C0603]
C191  C?  [C0603]
C192  C?  [C0603]
D161  WS2812  [WS2812_3528]
D162  WS2812  [WS2812_3528]
D163  WS2812  [WS2812_3528]
D164  WS2812  [WS2812_3528]
D165  WS2812  [WS2812_3528]
D166  WS2812  [WS2812_3528]
D167  WS2812  [WS2812_3528]
D168  WS2812  [WS2812_3528]
D169  WS2812  [WS2812_3528]
D170  WS2812  [WS2812_3528]
D171  WS2812  [WS2812_3528]
D172  WS2812  [WS2812_3528]
D173  WS2812  [WS2812_3528]
D174  WS2812  [WS2812_3528]
D175  WS2812  [WS2812_3528]
D176  WS2812  [WS2812_3528]
D177  WS2812  [WS2812_3528]
D178  WS2812  [WS2812_3528]
D179  WS2812  [WS2812_3528]
D180  WS2812  [WS2812_3528]
D181  WS2812  [WS2812_3528]
D182  WS2812  [WS2812_3528]
D183  WS2812  [WS2812_3528]
D184  WS2812  [WS2812_3528]
D185  WS2812  [WS2812_3528]
D186  WS2812  [WS2812_3528]
D187  WS2812  [WS2812_3528]
D188  WS2812  [WS2812_3528]
D189  WS2812  [WS2812_3528]
D190  WS2812  [WS2812_3528]
D191  WS2812  [WS2812_3528]
D192  WS2812  [WS2812_3528]

### Nets
GND: C161.2 C162.2 C163.2 C164.2 C165.2 C166.2 C167.2 C168.2 C169.2 C170.2 C171.2 C172.2 C173.2 C174.2 C175.2 C176.2 C177.2 C178.2 C179.2 C180.2 C181.2 C182.2 C183.2 C184.2 C185.2 C186.2 C187.2 C188.2 C189.2 C190.2 C191.2 C192.2 D161.3(GND) D162.3(GND) D163.3(GND) D164.3(GND) D165.3(GND) D166.3(GND) D167.3(GND) D168.3(GND) D169.3(GND) D170.3(GND) D171.3(GND) D172.3(GND) D173.3(GND) D174.3(GND) D175.3(GND) D176.3(GND) D177.3(GND) D178.3(GND) D179.3(GND) D180.3(GND) D181.3(GND) D182.3(GND) D183.3(GND) D184.3(GND) D185.3(GND) D186.3(GND) D187.3(GND) D188.3(GND) D189.3(GND) D190.3(GND) D191.3(GND) D192.3(GND)
VCC: C161.1 C162.1 C163.1 C164.1 C165.1 C166.1 C167.1 C168.1 C169.1 C170.1 C171.1 C172.1 C173.1 C174.1 C175.1 C176.1 C177.1 C178.1 C179.1 C180.1 C181.1 C182.1 C183.1 C184.1 C185.1 C186.1 C187.1 C188.1 C189.1 C190.1 C191.1 C192.1 D161.1(VDD) D162.1(VDD) D163.1(VDD) D164.1(VDD) D165.1(VDD) D166.1(VDD) D167.1(VDD) D168.1(VDD) D169.1(VDD) D170.1(VDD) D171.1(VDD) D172.1(VDD) D173.1(VDD) D174.1(VDD) D175.1(VDD) D176.1(VDD) D177.1(VDD) D178.1(VDD) D179.1(VDD) D180.1(VDD) D181.1(VDD) D182.1(VDD) D183.1(VDD) D184.1(VDD) D185.1(VDD) D186.1(VDD) D187.1(VDD) D188.1(VDD) D189.1(VDD) D190.1(VDD) D191.1(VDD) D192.1(VDD)
DIN2: D192.4(DIN)
DIN3: D161.2(DOUT)
NetD161_4: D161.4(DIN) D162.2(DOUT)
NetD162_4: D162.4(DIN) D163.2(DOUT)
NetD163_4: D163.4(DIN) D164.2(DOUT)
NetD164_4: D164.4(DIN) D165.2(DOUT)
NetD165_4: D165.4(DIN) D166.2(DOUT)
NetD166_4: D166.4(DIN) D167.2(DOUT)
NetD167_4: D167.4(DIN) D168.2(DOUT)
NetD168_4: D168.4(DIN) D169.2(DOUT)
NetD169_4: D169.4(DIN) D170.2(DOUT)
NetD170_4: D170.4(DIN) D171.2(DOUT)
NetD171_4: D171.4(DIN) D172.2(DOUT)
NetD172_4: D172.4(DIN) D173.2(DOUT)
NetD173_4: D173.4(DIN) D174.2(DOUT)
NetD174_4: D174.4(DIN) D175.2(DOUT)
NetD175_4: D175.4(DIN) D176.2(DOUT)
NetD176_4: D176.4(DIN) D177.2(DOUT)
NetD177_4: D177.4(DIN) D178.2(DOUT)
NetD178_4: D178.4(DIN) D179.2(DOUT)
NetD179_4: D179.4(DIN) D180.2(DOUT)
NetD180_4: D180.4(DIN) D181.2(DOUT)
NetD181_4: D181.4(DIN) D182.2(DOUT)
NetD182_4: D182.4(DIN) D183.2(DOUT)
NetD183_4: D183.4(DIN) D184.2(DOUT)
NetD184_4: D184.4(DIN) D185.2(DOUT)
NetD185_4: D185.4(DIN) D186.2(DOUT)
NetD186_4: D186.4(DIN) D187.2(DOUT)
NetD187_4: D187.4(DIN) D188.2(DOUT)
NetD188_4: D188.4(DIN) D189.2(DOUT)
NetD189_4: D189.4(DIN) D190.2(DOUT)
NetD190_4: D190.4(DIN) D191.2(DOUT)
NetD191_4: D191.4(DIN) D192.2(DOUT)

### Notes on the sheet
- Title
- Size:
- Date:
- A4
- Number:
- Time:
- Revision:
- Sheet
- of
- File:

### Library data of the parts
C161-C192 = CAP

## Sheet WS2812_MATRIX_7.SchDoc
size A4
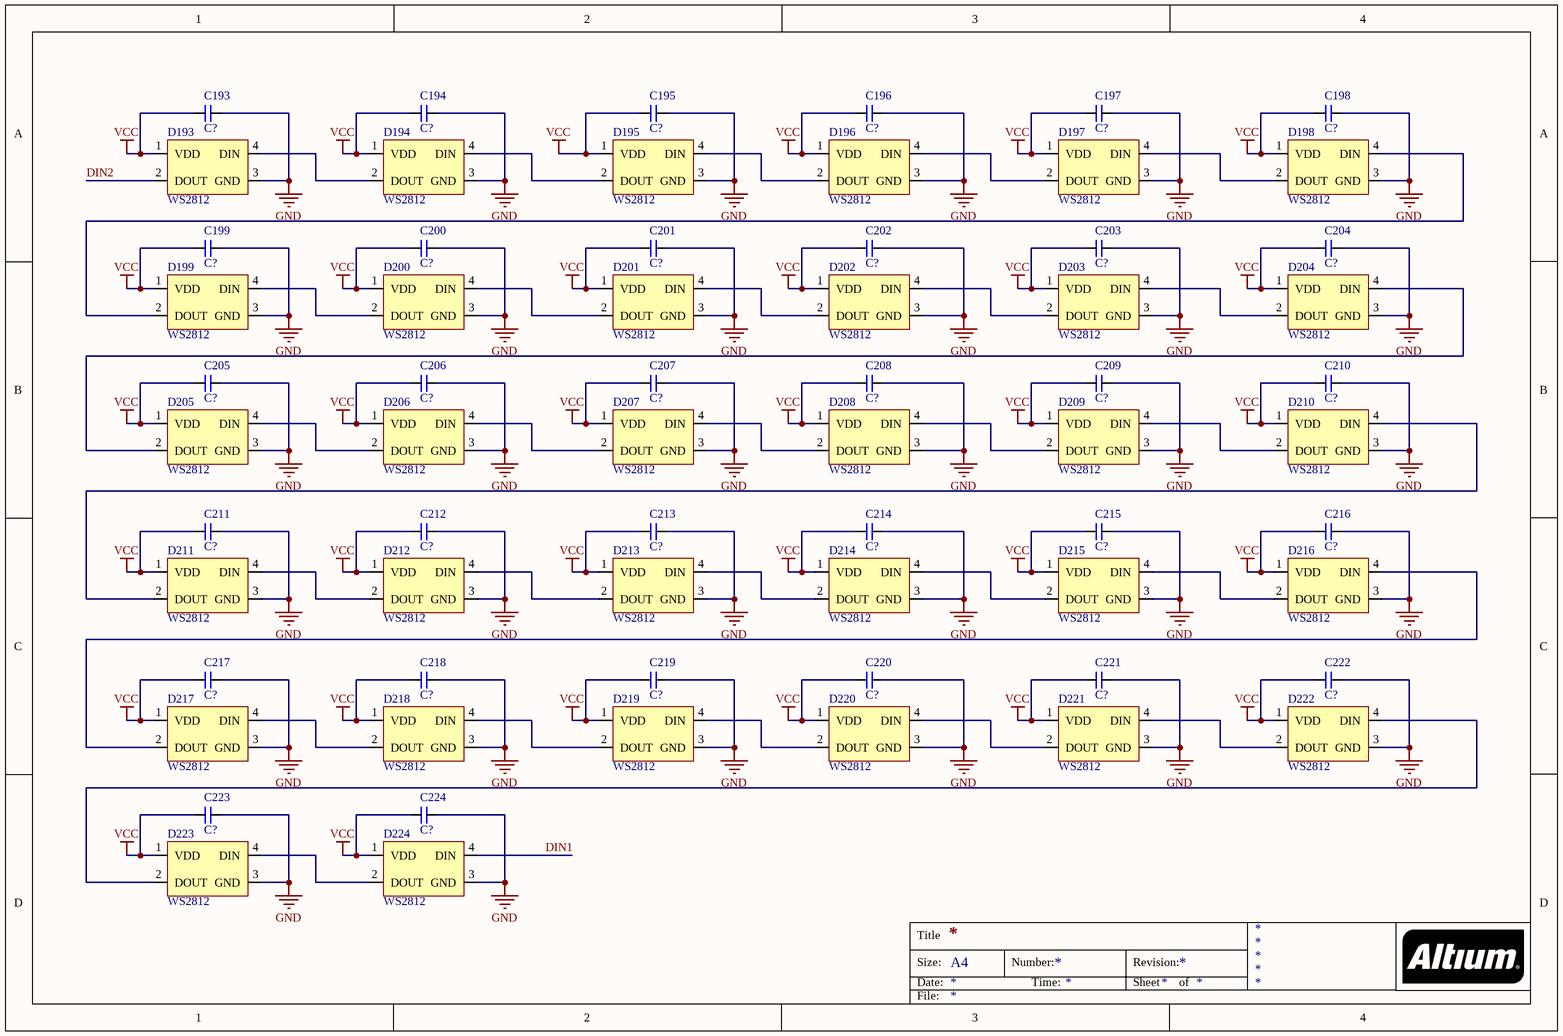
[diagram p6: WS2812_MATRIX_7.SchDoc]

### Parts
C193  C?  [C0603]
C194  C?  [C0603]
C195  C?  [C0603]
C196  C?  [C0603]
C197  C?  [C0603]
C198  C?  [C0603]
C199  C?  [C0603]
C200  C?  [C0603]
C201  C?  [C0603]
C202  C?  [C0603]
C203  C?  [C0603]
C204  C?  [C0603]
C205  C?  [C0603]
C206  C?  [C0603]
C207  C?  [C0603]
C208  C?  [C0603]
C209  C?  [C0603]
C210  C?  [C0603]
C211  C?  [C0603]
C212  C?  [C0603]
C213  C?  [C0603]
C214  C?  [C0603]
C215  C?  [C0603]
C216  C?  [C0603]
C217  C?  [C0603]
C218  C?  [C0603]
C219  C?  [C0603]
C220  C?  [C0603]
C221  C?  [C0603]
C222  C?  [C0603]
C223  C?  [C0603]
C224  C?  [C0603]
D193  WS2812  [WS2812_3528]
D194  WS2812  [WS2812_3528]
D195  WS2812  [WS2812_3528]
D196  WS2812  [WS2812_3528]
D197  WS2812  [WS2812_3528]
D198  WS2812  [WS2812_3528]
D199  WS2812  [WS2812_3528]
D200  WS2812  [WS2812_3528]
D201  WS2812  [WS2812_3528]
D202  WS2812  [WS2812_3528]
D203  WS2812  [WS2812_3528]
D204  WS2812  [WS2812_3528]
D205  WS2812  [WS2812_3528]
D206  WS2812  [WS2812_3528]
D207  WS2812  [WS2812_3528]
D208  WS2812  [WS2812_3528]
D209  WS2812  [WS2812_3528]
D210  WS2812  [WS2812_3528]
D211  WS2812  [WS2812_3528]
D212  WS2812  [WS2812_3528]
D213  WS2812  [WS2812_3528]
D214  WS2812  [WS2812_3528]
D215  WS2812  [WS2812_3528]
D216  WS2812  [WS2812_3528]
D217  WS2812  [WS2812_3528]
D218  WS2812  [WS2812_3528]
D219  WS2812  [WS2812_3528]
D220  WS2812  [WS2812_3528]
D221  WS2812  [WS2812_3528]
D222  WS2812  [WS2812_3528]
D223  WS2812  [WS2812_3528]
D224  WS2812  [WS2812_3528]

### Nets
GND: C193.2 C194.2 C195.2 C196.2 C197.2 C198.2 C199.2 C200.2 C201.2 C202.2 C203.2 C204.2 C205.2 C206.2 C207.2 C208.2 C209.2 C210.2 C211.2 C212.2 C213.2 C214.2 C215.2 C216.2 C217.2 C218.2 C219.2 C220.2 C221.2 C222.2 C223.2 C224.2 D193.3(GND) D194.3(GND) D195.3(GND) D196.3(GND) D197.3(GND) D198.3(GND) D199.3(GND) D200.3(GND) D201.3(GND) D202.3(GND) D203.3(GND) D204.3(GND) D205.3(GND) D206.3(GND) D207.3(GND) D208.3(GND) D209.3(GND) D210.3(GND) D211.3(GND) D212.3(GND) D213.3(GND) D214.3(GND) D215.3(GND) D216.3(GND) D217.3(GND) D218.3(GND) D219.3(GND) D220.3(GND) D221.3(GND) D222.3(GND) D223.3(GND) D224.3(GND)
VCC: C193.1 C194.1 C195.1 C196.1 C197.1 C198.1 C199.1 C200.1 C201.1 C202.1 C203.1 C204.1 C205.1 C206.1 C207.1 C208.1 C209.1 C210.1 C211.1 C212.1 C213.1 C214.1 C215.1 C216.1 C217.1 C218.1 C219.1 C220.1 C221.1 C222.1 C223.1 C224.1 D193.1(VDD) D194.1(VDD) D195.1(VDD) D196.1(VDD) D197.1(VDD) D198.1(VDD) D199.1(VDD) D200.1(VDD) D201.1(VDD) D202.1(VDD) D203.1(VDD) D204.1(VDD) D205.1(VDD) D206.1(VDD) D207.1(VDD) D208.1(VDD) D209.1(VDD) D210.1(VDD) D211.1(VDD) D212.1(VDD) D213.1(VDD) D214.1(VDD) D215.1(VDD) D216.1(VDD) D217.1(VDD) D218.1(VDD) D219.1(VDD) D220.1(VDD) D221.1(VDD) D222.1(VDD) D223.1(VDD) D224.1(VDD)
DIN1: D224.4(DIN)
DIN2: D193.2(DOUT)
NetD193_4: D193.4(DIN) D194.2(DOUT)
NetD194_4: D194.4(DIN) D195.2(DOUT)
NetD195_4: D195.4(DIN) D196.2(DOUT)
NetD196_4: D196.4(DIN) D197.2(DOUT)
NetD197_4: D197.4(DIN) D198.2(DOUT)
NetD198_4: D198.4(DIN) D199.2(DOUT)
NetD199_4: D199.4(DIN) D200.2(DOUT)
NetD200_4: D200.4(DIN) D201.2(DOUT)
NetD201_4: D201.4(DIN) D202.2(DOUT)
NetD202_4: D202.4(DIN) D203.2(DOUT)
NetD203_4: D203.4(DIN) D204.2(DOUT)
NetD204_4: D204.4(DIN) D205.2(DOUT)
NetD205_4: D205.4(DIN) D206.2(DOUT)
NetD206_4: D206.4(DIN) D207.2(DOUT)
NetD207_4: D207.4(DIN) D208.2(DOUT)
NetD208_4: D208.4(DIN) D209.2(DOUT)
NetD209_4: D209.4(DIN) D210.2(DOUT)
NetD210_4: D210.4(DIN) D211.2(DOUT)
NetD211_4: D211.4(DIN) D212.2(DOUT)
NetD212_4: D212.4(DIN) D213.2(DOUT)
NetD213_4: D213.4(DIN) D214.2(DOUT)
NetD214_4: D214.4(DIN) D215.2(DOUT)
NetD215_4: D215.4(DIN) D216.2(DOUT)
NetD216_4: D216.4(DIN) D217.2(DOUT)
NetD217_4: D217.4(DIN) D218.2(DOUT)
NetD218_4: D218.4(DIN) D219.2(DOUT)
NetD219_4: D219.4(DIN) D220.2(DOUT)
NetD220_4: D220.4(DIN) D221.2(DOUT)
NetD221_4: D221.4(DIN) D222.2(DOUT)
NetD222_4: D222.4(DIN) D223.2(DOUT)
NetD223_4: D223.4(DIN) D224.2(DOUT)

### Notes on the sheet
- Title
- Size:
- Date:
- A4
- Number:
- Time:
- Revision:
- Sheet
- of
- File:

### Library data of the parts
C193-C224 = CAP

## Sheet WS2812_MATRIX_8.SchDoc
size A4
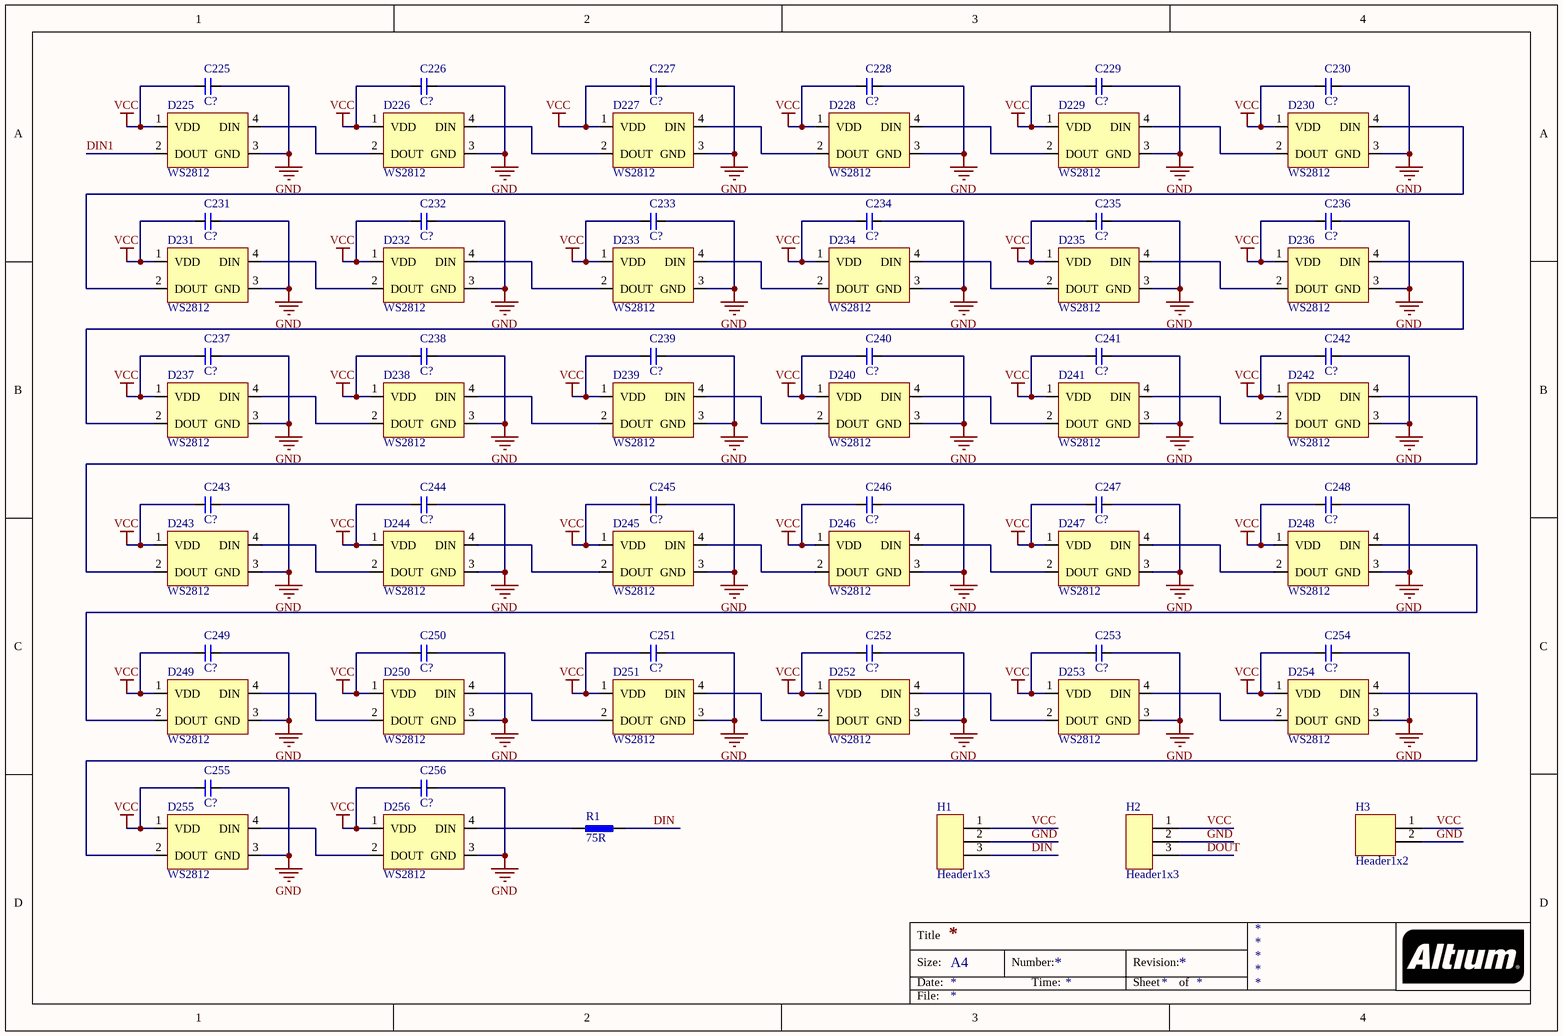
[diagram p7: WS2812_MATRIX_8.SchDoc]

### Parts
C225  C?  [C0603]
C226  C?  [C0603]
C227  C?  [C0603]
C228  C?  [C0603]
C229  C?  [C0603]
C230  C?  [C0603]
C231  C?  [C0603]
C232  C?  [C0603]
C233  C?  [C0603]
C234  C?  [C0603]
C235  C?  [C0603]
C236  C?  [C0603]
C237  C?  [C0603]
C238  C?  [C0603]
C239  C?  [C0603]
C240  C?  [C0603]
C241  C?  [C0603]
C242  C?  [C0603]
C243  C?  [C0603]
C244  C?  [C0603]
C245  C?  [C0603]
C246  C?  [C0603]
C247  C?  [C0603]
C248  C?  [C0603]
C249  C?  [C0603]
C250  C?  [C0603]
C251  C?  [C0603]
C252  C?  [C0603]
C253  C?  [C0603]
C254  C?  [C0603]
C255  C?  [C0603]
C256  C?  [C0603]
D225  WS2812  [WS2812_3528]
D226  WS2812  [WS2812_3528]
D227  WS2812  [WS2812_3528]
D228  WS2812  [WS2812_3528]
D229  WS2812  [WS2812_3528]
D230  WS2812  [WS2812_3528]
D231  WS2812  [WS2812_3528]
D232  WS2812  [WS2812_3528]
D233  WS2812  [WS2812_3528]
D234  WS2812  [WS2812_3528]
D235  WS2812  [WS2812_3528]
D236  WS2812  [WS2812_3528]
D237  WS2812  [WS2812_3528]
D238  WS2812  [WS2812_3528]
D239  WS2812  [WS2812_3528]
D240  WS2812  [WS2812_3528]
D241  WS2812  [WS2812_3528]
D242  WS2812  [WS2812_3528]
D243  WS2812  [WS2812_3528]
D244  WS2812  [WS2812_3528]
D245  WS2812  [WS2812_3528]
D246  WS2812  [WS2812_3528]
D247  WS2812  [WS2812_3528]
D248  WS2812  [WS2812_3528]
D249  WS2812  [WS2812_3528]
D250  WS2812  [WS2812_3528]
D251  WS2812  [WS2812_3528]
D252  WS2812  [WS2812_3528]
D253  WS2812  [WS2812_3528]
D254  WS2812  [WS2812_3528]
D255  WS2812  [WS2812_3528]
D256  WS2812  [WS2812_3528]
H1  Header1x3  [HDR1X3_2.54_NO_HOLE]
H2  Header1x3  [HDR1X3_2.54_NO_HOLE]
H3  Header1x2  [BATIN]
R1  75R  [R0603]

### Nets
GND: C225.2 C226.2 C227.2 C228.2 C229.2 C230.2 C231.2 C232.2 C233.2 C234.2 C235.2 C236.2 C237.2 C238.2 C239.2 C240.2 C241.2 C242.2 C243.2 C244.2 C245.2 C246.2 C247.2 C248.2 C249.2 C250.2 C251.2 C252.2 C253.2 C254.2 C255.2 C256.2 D225.3(GND) D226.3(GND) D227.3(GND) D228.3(GND) D229.3(GND) D230.3(GND) D231.3(GND) D232.3(GND) D233.3(GND) D234.3(GND) D235.3(GND) D236.3(GND) D237.3(GND) D238.3(GND) D239.3(GND) D240.3(GND) D241.3(GND) D242.3(GND) D243.3(GND) D244.3(GND) D245.3(GND) D246.3(GND) D247.3(GND) D248.3(GND) D249.3(GND) D250.3(GND) D251.3(GND) D252.3(GND) D253.3(GND) D254.3(GND) D255.3(GND) D256.3(GND) H1.2 H2.2 H3.2
VCC: C225.1 C226.1 C227.1 C228.1 C229.1 C230.1 C231.1 C232.1 C233.1 C234.1 C235.1 C236.1 C237.1 C238.1 C239.1 C240.1 C241.1 C242.1 C243.1 C244.1 C245.1 C246.1 C247.1 C248.1 C249.1 C250.1 C251.1 C252.1 C253.1 C254.1 C255.1 C256.1 D225.1(VDD) D226.1(VDD) D227.1(VDD) D228.1(VDD) D229.1(VDD) D230.1(VDD) D231.1(VDD) D232.1(VDD) D233.1(VDD) D234.1(VDD) D235.1(VDD) D236.1(VDD) D237.1(VDD) D238.1(VDD) D239.1(VDD) D240.1(VDD) D241.1(VDD) D242.1(VDD) D243.1(VDD) D244.1(VDD) D245.1(VDD) D246.1(VDD) D247.1(VDD) D248.1(VDD) D249.1(VDD) D250.1(VDD) D251.1(VDD) D252.1(VDD) D253.1(VDD) D254.1(VDD) D255.1(VDD) D256.1(VDD) H1.1 H2.1 H3.1
DIN: H1.3 R1.2
DIN1: D225.2(DOUT)
DOUT: H2.3
NetD225_4: D225.4(DIN) D226.2(DOUT)
NetD226_4: D226.4(DIN) D227.2(DOUT)
NetD227_4: D227.4(DIN) D228.2(DOUT)
NetD228_4: D228.4(DIN) D229.2(DOUT)
NetD229_4: D229.4(DIN) D230.2(DOUT)
NetD230_4: D230.4(DIN) D231.2(DOUT)
NetD231_4: D231.4(DIN) D232.2(DOUT)
NetD232_4: D232.4(DIN) D233.2(DOUT)
NetD233_4: D233.4(DIN) D234.2(DOUT)
NetD234_4: D234.4(DIN) D235.2(DOUT)
NetD235_4: D235.4(DIN) D236.2(DOUT)
NetD236_4: D236.4(DIN) D237.2(DOUT)
NetD237_4: D237.4(DIN) D238.2(DOUT)
NetD238_4: D238.4(DIN) D239.2(DOUT)
NetD239_4: D239.4(DIN) D240.2(DOUT)
NetD240_4: D240.4(DIN) D241.2(DOUT)
NetD241_4: D241.4(DIN) D242.2(DOUT)
NetD242_4: D242.4(DIN) D243.2(DOUT)
NetD243_4: D243.4(DIN) D244.2(DOUT)
NetD244_4: D244.4(DIN) D245.2(DOUT)
NetD245_4: D245.4(DIN) D246.2(DOUT)
NetD246_4: D246.4(DIN) D247.2(DOUT)
NetD247_4: D247.4(DIN) D248.2(DOUT)
NetD248_4: D248.4(DIN) D249.2(DOUT)
NetD249_4: D249.4(DIN) D250.2(DOUT)
NetD250_4: D250.4(DIN) D251.2(DOUT)
NetD251_4: D251.4(DIN) D252.2(DOUT)
NetD252_4: D252.4(DIN) D253.2(DOUT)
NetD253_4: D253.4(DIN) D254.2(DOUT)
NetD254_4: D254.4(DIN) D255.2(DOUT)
NetD255_4: D255.4(DIN) D256.2(DOUT)
NetD256_4: D256.4(DIN) R1.1

### Notes on the sheet
- Title
- Size:
- Date:
- A4
- Number:
- Time:
- Revision:
- Sheet
- of
- File:

### Library data of the parts
C225-C256 = CAP
R1 = RES

## Nets that join several sheets
GND: WS2812_MATRIX_1 (64 pins), WS2812_MATRIX_2 (64 pins), WS2812_MATRIX_3 (64 pins), WS2812_MATRIX_4 (64 pins), WS2812_MATRIX_5 (64 pins), WS2812_MATRIX_6 (64 pins), WS2812_MATRIX_7 (64 pins), WS2812_MATRIX_8 (67 pins)
VCC: WS2812_MATRIX_1 (64 pins), WS2812_MATRIX_2 (64 pins), WS2812_MATRIX_3 (64 pins), WS2812_MATRIX_4 (64 pins), WS2812_MATRIX_5 (64 pins), WS2812_MATRIX_6 (64 pins), WS2812_MATRIX_7 (64 pins), WS2812_MATRIX_8 (67 pins)
DIN1: WS2812_MATRIX_7 (D224.4), WS2812_MATRIX_8 (D225.2)
DIN2: WS2812_MATRIX_6 (D192.4), WS2812_MATRIX_7 (D193.2)
DIN3: WS2812_MATRIX_5 (D160.4), WS2812_MATRIX_6 (D161.2)
DIN4: WS2812_MATRIX_4 (D128.4), WS2812_MATRIX_5 (D129.2)
DIN5: WS2812_MATRIX_3 (D96.4), WS2812_MATRIX_4 (D97.2)
DIN6: WS2812_MATRIX_2 (D64.4), WS2812_MATRIX_3 (D65.2)
DIN7: WS2812_MATRIX_1 (D32.4), WS2812_MATRIX_2 (D33.2)
DOUT: WS2812_MATRIX_1 (D1.2), WS2812_MATRIX_8 (H2.3)